# Altium schematic sheet flyback.SchDoc
size A4; SheetNumber: 4
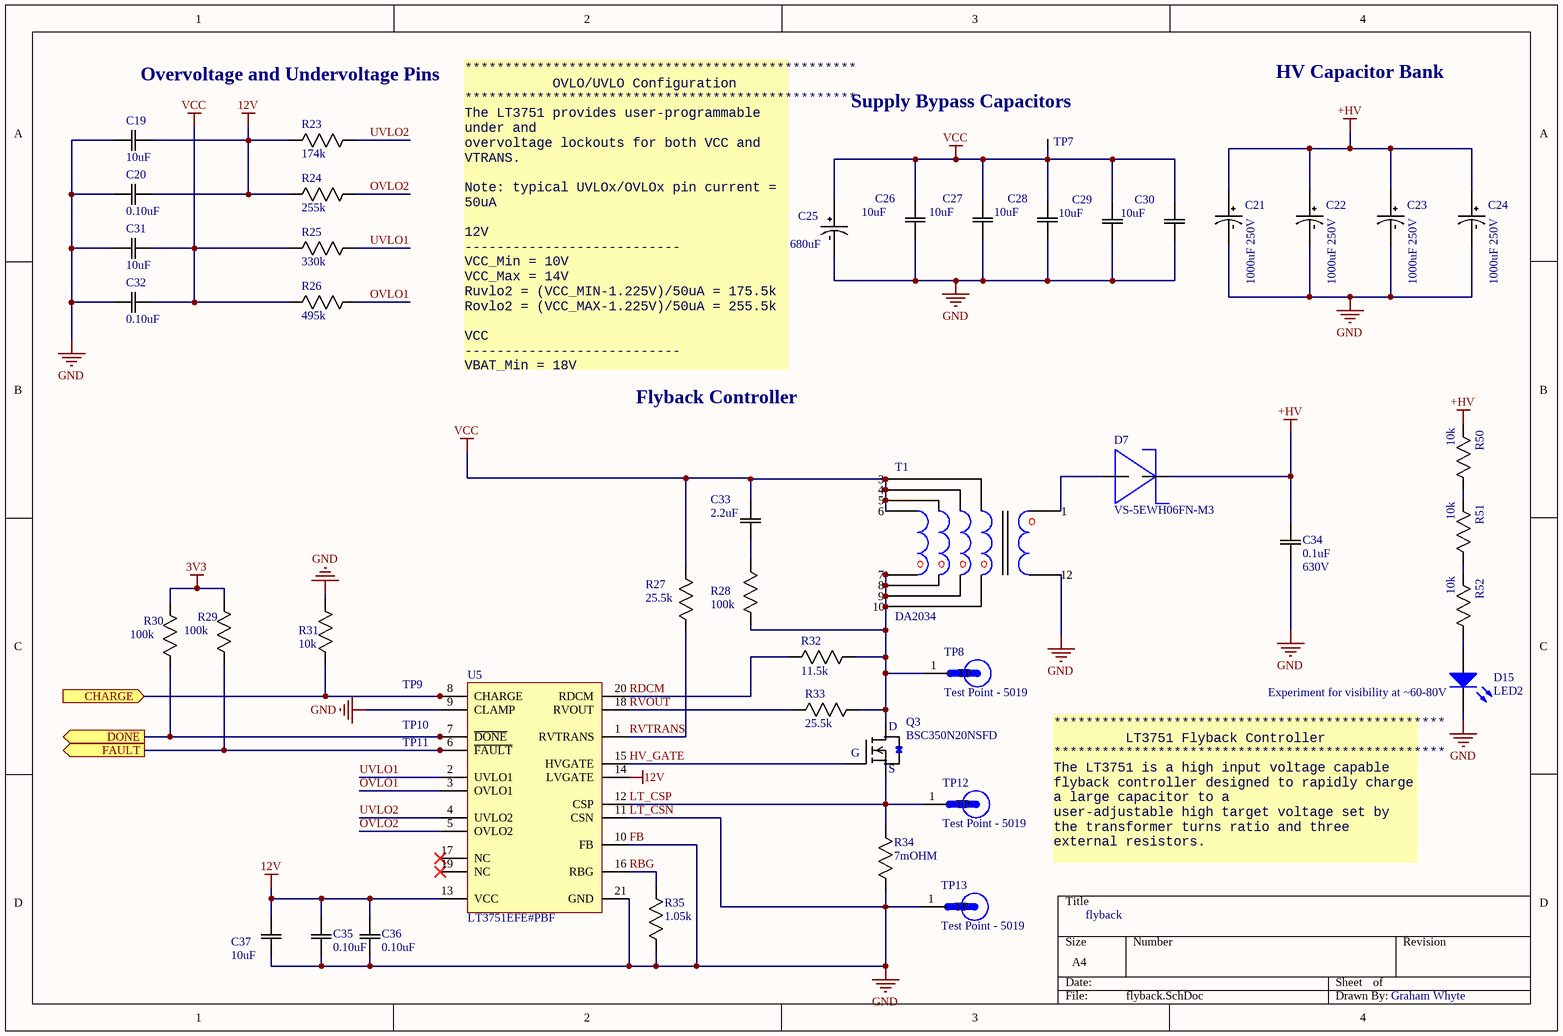
[diagram p0: flyback.SchDoc]

## Parts
C19  10uF  [0805]
C20  0.10uF  [0805]
C21  1000uF 250V  [RADIAL, CAN - THRU 25.4mm]
C22  1000uF 250V  [RADIAL, CAN - THRU 25.4mm]
C23  1000uF 250V  [RADIAL, CAN - THRU 25.4mm]
C24  1000uF 250V  [RADIAL, CAN - THRU 25.4mm]
C25  680uF  [RADIAL, CAN - THRU 10mm - RIGHTANGLE]
C26  10uF  [1210]
C27  10uF  [1210]
C28  10uF  [1210]
C29  10uF  [1210]
C30  10uF  [1210]
C31  10uF  [0805]
C32  0.10uF  [0805]
C33  2.2uF  [0805]
C34  Rating: 630V  [1210]  (hidden comment: 0.1uF)
C35  0.10uF  [0805]
C36  0.10uF  [0805]
C37  10uF  [0805]
D7  VS-5EWH06FN-M3  [DPAK (TO-252)]
D15  LED2  [3.2X1.6X1.1]
Q3  BSC350N20NSFD  [8-PowerSMD]
R23  174k  [0805]
R24  255k  [0805]
R25  330k  [0805]
R26  495k  [0805]
R27  25.5k  [0805]
R28  100k  [0805]
R29  100k  [0805]
R30  100k  [0805]
R31  10k  [0805]
R32  11.5k  [0805]
R33  25.5k  [0805]
R34  7mOHM  [2512]
R35  1.05k  [0805]
R50  10k  [1206]
R51  10k  [1206]
R52  10k  [1206]
T1  DA2034  [DA2034]
TP7  Test Point (Via)  [TP]  (value not drawn)
TP8  Test Point - 5019  [TP380X203]
TP9  Test Point (Via)  [TP]  (value not drawn)
TP10  Test Point (Via)  [TP]  (value not drawn)
TP11  Test Point (Via)  [TP]  (value not drawn)
TP12  Test Point - 5019  [TP380X203]
TP13  Test Point - 5019  [TP380X203]
U5  LT3751EFE#PBF  [LT-FE-20-EPV-CB_L]

## Ports
CHARGE (in), DONE (out), FAULT (out)

## Nets
3V3: R29.2(R2) R30.2(R2)
12V: C19.2(C2) C20.2(C2) C35.1(C1) C36.1(C1) C37.1(C1) R23.2(R2) R24.2(R2) U5.13(VCC) U5.14(LVGATE)
+HV: C21.POS C22.POS C23.POS C24.POS C34.1(C1) D7.OUT R50.2(R2)
FB: C19.1(C1) C20.1(C1) C21.NEG C22.NEG C23.NEG C24.NEG C25.NEG C26.1(C1) C27.1(C1) C28.1(C1) C29.1(C1) C30.1(C1) C31.1(C1) C32.1(C1) C34.2(C2) C35.2(C2) C36.2(C2) C37.2(C2) D15.2(K) R31.1(R1) R34.1(R1) R35.2(R2) T1.12 TP13.1(TP) U5.9(CLAMP) U5.10(FB) U5.11(CSN) U5.21(GND)  [also labelled GND, LT_CSN]
VCC: C25.POS C26.2(C2) C27.2(C2) C28.2(C2) C29.2(C2) C30.2(C2) C31.2(C2) C32.2(C2) C33.2(C2) R25.2(R2) R26.2(R2) R27.1(R1) T1.3 T1.4 T1.5 T1.6 TP7.1
CHARGE: R31.2(R2) TP9.1 U5.8(CHARGE) ; port CHARGE
DONE: R30.1(R1) TP10.1 U5.7(~{DONE}) ; port DONE
FAULT: R29.1(R1) TP11.1 U5.6(~{FAULT}) ; port FAULT
HV_GATE: Q3.G U5.15(HVGATE)
LT_CSP: Q3.S R34.2(R2) TP12.1(TP) U5.12(CSP)
OVLO1: R26.1(R1) U5.3(OVLO1)
OVLO2: R24.1(R1) U5.5(OVLO2)
RBG: R35.1(R1) U5.16(RBG)
RDCM: R32.2(R2) U5.20(RDCM)
RVOUT: R33.2(R2) U5.18(RVOUT)
RVTRANS: R27.2(R2) U5.1(RVTRANS)
UVLO1: R25.1(R1) U5.2(UVLO1)
UVLO2: R23.1(R1) U5.4(UVLO2)
NetC33_1: C33.1(C1) R28.1(R1)
NetD7_IN: D7.IN T1.1
NetD15_1: D15.1(A) R52.1(R1)
NetQ3_D: Q3.D R28.2(R2) R32.1(R1) R33.1(R1) T1.7 T1.8 T1.9 T1.10 TP8.1(TP)
NetR50_1: R50.1(R1) R51.2(R2)
NetR51_1: R51.1(R1) R52.2(R2)

Not connected (* = marked no-connect by the designer): U5 17(NC)* 19(NC)*

## Notes on the sheet
- Overvoltage and Undervoltage Pins
- (near TP7) Supply Bypass Capacitors
- HV Capacitor Bank
- (near C25) *************************************************
  OVLO/UVLO Configuration
  *************************************************
  The LT3751 provides user-programmable under and
  overvoltage lockouts for both VCC and VTRANS.
  Note: typical UVLOx/OVLOx pin current = 50uA
  12V
  ---------------------------
  VCC_Min = 10V
  VCC_Max = 14V
  Ruvlo2 = (VCC_MIN-1.225V)/50uA = 175.5k
  Rovlo2 = (VCC_MAX-1.225V)/50uA = 255.5k
  VCC
  ---------------------------
  VBAT_Min = 18V
  VBAT_Max = 26V
  Ruvlo1 = (VBAT_MIN-1.225V)/50uA = 335.5k
  Rovlo1 = (VBAT_MAX-1.225V)/50uA = 495.5k
- Flyback Controller
- (near D15) Experiment for visibility at ~60-80V
- (near D15) *************************************************
  LT3751 Flyback Controller
  *************************************************
  The LT3751 is a high input voltage capable flyback controller designed to rapidly charge a large capacitor to a
  user-adjustable high target voltage set by the transformer turns ratio and three external resistors.
- flyback
- Graham Whyte

## Library data of the parts
C19 C26-C31 C37 = CAP 10uF 35V: CAP CER 10UF 35V X7R 0805; Tolerance: 10%; Package: 0805; Value: 10uF; Rating: 35V; Temperature Coefficient: X7R; Operating Temperature: -55°C ~ 125°C
C20 C32 C35 C36 = CAP 0.10uF 35V: CAP CER 0.10UF 35V X7R 0603/0805; Tolerance: 10%; Package: 0603/0805; Temperature Coefficient: X7R; Operating Temperature: -55°C ~ 125°C; Value: 0.10uF
C21-C24 = CAP POL 1000uF: United Chemi-Con / ESMQ251VSN102MQ45S; Dielectric Material: Aluminium; Life (Hours): 2000Hour; Capacitance: 1mF; Tolerance: 20%; Ripple Current: 960mA; Lead Diameter: 2mm; Supplier 1: Digi-Key; Manufacturer: United Chemi-Con; Manufacturer Part Number: ESMQ251VSN102MQ45S; RoHS: Yes; Mount: Through Hole,PCB; Case/Package: Radial; Number of Pins: 2; Min Operating Temperature: -40°C; Max Operating Temperature: 85°C; Termination: Radial; Voltage: 250V; Diameter: 25.4mm; Height - Seated (Max): 45mm; Lead Pitch: 10mm; REACH SVHC: No SVHC; Lead Free: Lead Free; Supplier Part Number 1: 565-2754-ND
C25 = CAP POL 680uF TH: NICHICON   UHW1V681MPD6 ALUMINUM ELECTROLYTIC CAPACITOR, 680UF, 35V, 20%, RADIAL, FULL REEL; Dielectric Material: Aluminium; Tolerance: 20%; Supplier 1: Digi-Key; Manufacturer: Nichicon; Manufacturer Part Number: UHW1V681MPD6; RoHS: Yes; Case/Package: Radial; Number of Pins: 2; Capacitance: 680uF; Termination: Radial; Voltage: 35V; Supplier Part Number 1: 493-6804-ND
C33 = CAP 2.2uF 16V: CAP CER 2.2UF 16V X5R 0603/0805; Tolerance: 10%; Package: 0603/0805; Value: 2.2uF; Rating: 16V; Temperature Coefficient: X5R; Operating Temperature: -55°C ~ 85°C
C34 = CAP 0.1uF 630V: CAP CER 0.1uF 630V X7R 1210; Tolerance: 10%; Package: 1210; Temperature Coefficient: X7R; Operating Temperature: -55°C ~ 125°C; Value: 0.1uF
D7 = VS-5EWH06FN-M3: Diode Switching 600V 5A DPAK; pin to pad: IN>3 OUT>2; MF: Vishay Diodes; MF PN: VS-5EWH06FN-M3; Digikey: VS-5EWH06FN-M3-ND; Digikey Link: https://www.digikey.ca/en/products/detail/vishay-semiconductor-diodes-division/VS-5EWH06FN-M3/4934509
D15 = LED GREEN SMD: Typical RED, GREEN, YELLOW, AMBER GaAs LED; Voltage - Forward (Vf) (Typ): 2V; Lens Transparency: Clear; Current - Test: 20mA; Package: 1206; Color: Green
Q3 = MOSFET BSC320N20NS3: MOSFET N-CH 36A 200V; MF: Infineon; Package: 8-PowerTDFN; Digikey: BSC320N20NS3GATMA1CT-ND; Digikey Link: https://www.digikey.ca/en/products/detail/infineon-technologies/BSC320N20NS3GATMA1/2337851; Supplier 1: Digi-Key; Supplier Part Number 1: BSC320N20NS3GATMA1CT-ND
R23 = RES 174k 1/8W: RES SMD 174K OHM 1% 1/8W 0805; Manufacturer: Yageo; Manufacturer Part Number: RC0805FR-07174KL; Max Power Dissipation: 125mW; Resistance: 174kR; Temperature Coefficient: 100ppm/°C; Voltage Rating: 150V; Supplier 1: Digi-Key; RoHS: Yes; Category: Chip SMD Resistors; Stock 1: 27863; Pricing 1: 1=0.10000, 10=0.04000, 100=0.01630, 1000=0.00731, 2500=0.00635 (USD); Case/Package: 0805; Case Code (Metric): 2012; Case Code (Imperial): 0805; Contact Plating: Tin,Matte; Min Operating Temperature: -55°C; Max Operating Temperature: 155°C; Package Quantity: 1; Power Rating: 125mW; Tolerance: 1%; Packaging: Tape and Reel; Features: Moisture Resistant; Composition: Thick Film; Number of Terminations: 2; Termination: SMD/SMT; Military Standard: Not; Voltage Rating (DC): 150V; Length: 2mm; Height: 0.024inch; Width: 0.049inch; Depth: 1.25mm; Radiation Hardening: No; Lead Free: Lead Free; ComponentLink1URL: https://datasheet.ciiva.com/2509/pyu-r-int-thick-7-2509472.pdf?src-supplier=Digi-Key; ComponentLink1Description: https://datasheet.ciiva.com/2509/pyu-r-int-thick-7-2509472.pdf?src-supplier=Digi-Key; ComponentLink2URL: https://datasheet.ciiva.com/2509/pyu-r-int-thick-7-2509471.pdf?src-supplier=Digi-Key; ComponentLink2Description: https://datasheet.ciiva.com/2509/pyu-r-int-thick-7-2509471.pdf?src-supplier=Digi-Key; ComponentLink3URL: https://datasheet.ciiva.com/2509/pyu-r-int-thick-7-2509473.pdf?src-supplier=Digi-Key; ComponentLink3Description: https://datasheet.ciiva.com/2509/pyu-r-int-thick-7-2509473.pdf?src-supplier=Digi-Key; Supplier Part Number 1: 311-174KCRCT-ND
R24 = RES 255k 0805: 0805 Resistor, 6A, 0.125W, 25ppm, 0.1%, 255K; Manufacturer: Panasonic; Manufacturer Part Number: ERA-6AEB2553V; Max Power Dissipation: 125mW; Resistance: 255kR; Temperature Coefficient: 25ppm/°C; Voltage Rating (DC): 100V; Voltage Rating: 200V; Supplier 1: Digi-Key; RoHS: Yes; Category: Chip SMD Resistors; Stock 1: 7869; Pricing 1: 1=0.36000, 10=0.30200, 100=0.11820, 1000=0.04948, 2500=0.04536 (USD); Mount: Surface Mount; Case/Package: 0805; Number of Pins: 2; Weight: 0.000194oz; Case Code (Imperial): 0805; Case Code (Metric): 2012; Contact Plating: Tin; Min Operating Temperature: -55°C; Max Operating Temperature: 155°C; Features: Automotive AEC-Q200; Tolerance: 0.1%; Number of Terminations: 2; Packaging: Tape and Reel; Composition: Metal Film,Thin Film; Power Rating: 125mW; Termination: SMD/SMT; Military Standard: Not; Package Quantity: 1; Length: 2mm; Height: 0.5mm; Width: 1.25mm; Depth: 1.25mm; Radiation Hardening: No; Lead Free: Lead Free; REACH SVHC: No SVHC; ComponentLink1URL: https://datasheet.ciiva.com/11810/0900766b80eb1d8c-11810615.pdf?src-supplier=RSComponents; ComponentLink1Description: https://datasheet.ciiva.com/11810/0900766b80eb1d8c-11810615.pdf?src-supplier=RSComponents; ComponentLink2URL: https://datasheet.ciiva.com/41450/001181380-da-01-en-widerstand-era-0805-255k-0-1-5000st-41450539.pdf?src-supplier=Conrad; ComponentLink2Description: https://datasheet.ciiva.com/41450/001181380-da-01-en-widerstand-era-0805-255k-0-1-5000st-41450539.pdf?src-supplier=Conrad; ComponentLink3URL: https://datasheet.ciiva.com/5981/485442-5981317.pdf?src-supplier=Farnell; ComponentLink3Description: https://datasheet.ciiva.com/5981/485442-5981317.pdf?src-supplier=Farnell; ComponentLink4URL: https://datasheet.ciiva.com/5981/485442-5981318.pdf?src-supplier=Farnell; ComponentLink4Description: https://datasheet.ciiva.com/5981/485442-5981318.pdf?src-supplier=Farnell; ComponentLink5URL: https://datasheet.ciiva.com/5981/485442-5981319.pdf?src-supplier=Farnell; ComponentLink5Description: https://datasheet.ciiva.com/5981/485442-5981319.pdf?src-supplier=Farnell; ComponentLink6URL: https://datasheet.ciiva.com/5981/485442-5981320.pdf?src-supplier=Farnell; ComponentLink6Description: https://datasheet.ciiva.com/5981/485442-5981320.pdf?src-supplier=Farnell; ComponentLink7URL: https://datasheet.ciiva.com/17206/aoa0000ce26-17206655.pdf?src-supplier=Avnet+Europe; ComponentLink7Description: https://datasheet.ciiva.com/17206/aoa0000ce26-17206655.pdf?src-supplier=Avnet+Europe; Supplier Part Number 1: P255KDACT-ND
R25 = RES 330k 1/8W - 1%: RES SMD 274K OHM 1% 1/8W 0805
R26 = RES 495k 1/8W: RES SMD 499K OHM 1% 1/8W 0805; Manufacturer: Yageo; Manufacturer Part Number: RC0805FR-07499KL; Temperature Coefficient: 100ppm/°C; Voltage Rating (DC): 150V; Resistance: 499kR; Power Rating: 125mW; Supplier 1: Digi-Key; RoHS: Yes; Category: Chip SMD Resistors; Stock 1: 2275; Pricing 1: 1=0.10000, 10=0.04000, 100=0.01630, 1000=0.00731, 2500=0.00635 (USD); Case/Package: 0805; Case Code (Metric): 2012; Case Code (Imperial): 0805; Contact Plating: Tin,Lead,Matte; Min Operating Temperature: -55°C; Max Operating Temperature: 155°C; Termination: SMD/SMT; Composition: Thick Film; Military Standard: Not; Tolerance: 1%; Voltage Rating: 150V; Packaging: Tape and Reel; Length: 2mm; Depth: 1.25mm; Radiation Hardening: No; Lead Free: Lead Free; ComponentLink1URL: https://datasheet.ciiva.com/15189/getdatasheetpartid-326570-15189975.pdf?src-supplier=Verical; ComponentLink1Description: https://datasheet.ciiva.com/15189/getdatasheetpartid-326570-15189975.pdf?src-supplier=Verical; Supplier Part Number 1: 311-499KCRCT-ND
R27 R33 = RES 25.5k 1/8W: RES SMD 25.5K OHM 0.1% 1/8W 0805; Manufacturer: Panasonic; Manufacturer Part Number: ERA-6AEB2552V; Temperature Coefficient: 25ppm/°C; Max Power Dissipation: 125mW; Resistance: 25.5kR; Voltage Rating: 100V; Supplier 1: Digi-Key; RoHS: Yes; Category: Chip SMD Resistors; Stock 1: 5872; Pricing 1: 1=0.36000, 10=0.30200, 100=0.11820, 1000=0.04948, 2500=0.04536 (USD); Mount: Surface Mount; Case/Package: 0805; Number of Pins: 2; Case Code (Imperial): 0805; Case Code (Metric): 2012; Contact Plating: Tin; Min Operating Temperature: -55°C; Max Operating Temperature: 155°C; Number of Terminations: 2; Features: Automotive AEC-Q200; Tolerance: 0.1%; Composition: Metal Film,Thin Film; Packaging: Tape and Reel; Military Standard: Not; Termination: Solder; Power Rating: 125mW; Package Quantity: 1; Voltage Rating (DC): 100V; Length: 2mm; Height: 0.5mm; Width: 1.25mm; Depth: 1.25mm; Radiation Hardening: No; Lead Free: Lead Free; ComponentLink1URL: https://datasheet.ciiva.com/11810/0900766b80eb1d8c-11810651.pdf?src-supplier=RSComponents; ComponentLink1Description: https://datasheet.ciiva.com/11810/0900766b80eb1d8c-11810651.pdf?src-supplier=RSComponents; ComponentLink2URL: https://datasheet.ciiva.com/26335/459526-da-01-en-widerstand-0805-era-26335831.pdf?src-supplier=Conrad; ComponentLink2Description: https://datasheet.ciiva.com/26335/459526-da-01-en-widerstand-0805-era-26335831.pdf?src-supplier=Conrad; ComponentLink3URL: https://datasheet.ciiva.com/7870/485442-7870651.pdf?src-supplier=Element14; ComponentLink3Description: https://datasheet.ciiva.com/7870/485442-7870651.pdf?src-supplier=Element14; ComponentLink4URL: https://datasheet.ciiva.com/5987/485442-5987308.pdf?src-supplier=Farnell; ComponentLink4Description: https://datasheet.ciiva.com/5987/485442-5987308.pdf?src-supplier=Farnell; ComponentLink5URL: https://datasheet.ciiva.com/7870/485442-7870652.pdf?src-supplier=Element14; ComponentLink5Description: https://datasheet.ciiva.com/7870/485442-7870652.pdf?src-supplier=Element14; ComponentLink6URL: https://datasheet.ciiva.com/30151/54aoa0000ce26-30151583.pdf?src-supplier=Onlinecomponents.com; ComponentLink6Description: https://datasheet.ciiva.com/30151/54aoa0000ce26-30151583.pdf?src-supplier=Onlinecomponents.com; ComponentLink7URL: https://datasheet.ciiva.com/9191/aoa0000ce26-9191422.pdf?src-supplier=Avnet; ComponentLink7Description: https://datasheet.ciiva.com/9191/aoa0000ce26-9191422.pdf?src-supplier=Avnet; Supplier Part Number 1: P25.5KDACT-ND
R28-R30 = RES 100k 1/8W - 1%: RES SMD 100K OHM 1% 1/8W 0805; Power (Watts): 0.125W; Package: 0805; Value: 100k; Tolerance: 1%
R31 = RES 10k 1/8W - 1%: RES SMD 10K OHM 1% 1/8W 0805; Power (Watts): 0.125W; Package: 0805; Value: 10k; Tolerance: 1%
R32 = RES 11.5k 1/8W: RES SMD 11.5K OHM 0.1% 1/8W 0805 Thin Film; Manufacturer: Panasonic; Manufacturer Part Number: ERA-6AEB1152V; Power Rating: 125mW; Resistance: 11.5kR; Voltage Rating: 100V; Temperature Coefficient: 25ppm/°C; Supplier 1: Digi-Key; RoHS: Yes; Category: Chip SMD Resistors; Stock 1: 10661; Pricing 1: 1=0.34000, 10=0.28800, 100=0.11260, 1000=0.04712, 2500=0.04320 (USD); Mount: Surface Mount; Case/Package: 0805; Number of Pins: 2; Case Code (Metric): 2012; Case Code (Imperial): 0805; Contact Plating: Tin; Min Operating Temperature: -55°C; Max Operating Temperature: 155°C; Tolerance: 0.1%; Packaging: Tape and Reel; Max Power Dissipation: 125mW; Composition: Thin Film,Metal Film; Number of Terminations: 2; Voltage Rating (DC): 100V; Termination: Solder; Military Standard: Not; Package Quantity: 1; Features: Automotive AEC-Q200; Length: 2mm; Height: 0.5mm; Width: 1.25mm; Depth: 1.25mm; Radiation Hardening: No; Lead Free: Lead Free; ComponentLink1URL: https://datasheet.ciiva.com/11810/0900766b80eb1d8c-11810868.pdf?src-supplier=RSComponents; ComponentLink1Description: https://datasheet.ciiva.com/11810/0900766b80eb1d8c-11810868.pdf?src-supplier=RSComponents; ComponentLink2URL: https://datasheet.ciiva.com/41450/001181306-da-01-en-widerstand-era-0805-11k5-0-1-5000st-41450464.pdf?src-supplier=Conrad; ComponentLink2Description: https://datasheet.ciiva.com/41450/001181306-da-01-en-widerstand-era-0805-11k5-0-1-5000st-41450464.pdf?src-supplier=Conrad; ComponentLink3URL: https://datasheet.ciiva.com/5987/485442-5987301.pdf?src-supplier=Farnell; ComponentLink3Description: https://datasheet.ciiva.com/5987/485442-5987301.pdf?src-supplier=Farnell; ComponentLink4URL: https://datasheet.ciiva.com/7829/485442-7829142.pdf?src-supplier=Element14; ComponentLink4Description: https://datasheet.ciiva.com/7829/485442-7829142.pdf?src-supplier=Element14; ComponentLink5URL: https://datasheet.ciiva.com/17211/aoa0000ce26-17211855.pdf?src-supplier=Avnet+Europe; ComponentLink5Description: https://datasheet.ciiva.com/17211/aoa0000ce26-17211855.pdf?src-supplier=Avnet+Europe; ComponentLink6URL: https://datasheet.ciiva.com/7829/485442-7829143.pdf?src-supplier=Element14; ComponentLink6Description: https://datasheet.ciiva.com/7829/485442-7829143.pdf?src-supplier=Element14; ComponentLink7URL: https://datasheet.ciiva.com/9193/aoa0000ce26-9193735.pdf?src-supplier=Avnet; ComponentLink7Description: https://datasheet.ciiva.com/9193/aoa0000ce26-9193735.pdf?src-supplier=Avnet; ComponentLink8URL: https://datasheet.ciiva.com/24024/aoa0000ce26-197354-24024328.pdf?src-supplier=Mouser; ComponentLink8Description: https://datasheet.ciiva.com/24024/aoa0000ce26-197354-24024328.pdf?src-supplier=Mouser; Supplier Part Number 1: P11.5KDACT-ND
R34 = RES 7m 3W: RES SMD 7m OHM 1% 3W 2512; MFG: VISHAY; Package: 1206; Resistance: 7mOHM; Power (Watts): 3W; Tolerance: 1%
R35 = RES 1.05k 1/8W: RES SMD 1.05K OHM 0.1% 1/8W 0805; Wattage: 0.125W; Supplier 1: Digi-Key; Tolerance: 0.1%; Supplier Part Number 1: P1.05KDACT-ND; Value: 1.05k; Package: 0805
R50-R52 = RES 10k 1W: RES SMD 10K OHM 1% 1W 1206; Power (Watts): 0.125W; Package: 0805; Value: 10k; Tolerance: 1%
T1 = DA2034: Audio Transformers / Signal Transformers DA2032 Cap Chrgr For Linear LT3750/51; Supplier 1: Mouser; Supplier Part Number 1: 994-DA2034-ALB
TP8 TP12 TP13 = Test Point - 5019: PC Test Point, Miniature Phosphor Bronze, Silver Plating Surface Mount Mounting Type; MP: 5019; MF: Keystone Electronics; Value: *; Package: 2010 Keystone; Digi-Key_Part_Number: 36-5019CT-ND; Digi-Key_Purchase_URL: https://www.digikey.com/product-detail/en/keystone-electronics/5019/36-5019CT-ND/3907344?utm_source=snapeda&utm_medium=aggregator&utm_campaign=symbol
U5 = LT3751EFE#PBF: Controller to 20-Pin TSSOP EP; Manufacturer: Analog Devices / Linear Technology; Output Voltage: 500V; Output Current: 150mA; Max Input Voltage: 24V; Min Supply Voltage: 4.75V; Number of Outputs: 1; Operating Supply Current: 5.5mA; Supplier 1: Digi-Key; Manufacturer Part Number: LT3751EFE#PBF; RoHS: Yes; Category: Voltage Regulators - Switching; Stock 1: 1231; Pricing 1: 1=9.26000, 25=6.14640, 100=5.08200, 250=4.82792, 500=4.71900 (USD); Case/Package: TSSOP; Number of Pins: 20; Min Operating Temperature: -40°C; Max Operating Temperature: 125°C; Package Quantity: 74; Packaging: Rail/Tube; Termination: SMD/SMT; Max Supply Voltage: 24V; Radiation Hardening: No; REACH SVHC: No SVHC; ComponentLink1URL: https://datasheet.ciiva.com/15104/getdatasheetpartid-472813-15104438.pdf?src-supplier=Verical; ComponentLink1Description: https://datasheet.ciiva.com/15104/getdatasheetpartid-472813-15104438.pdf?src-supplier=Verical; ComponentLink2URL: https://datasheet.ciiva.com/31429/1692507-31429494.pdf?src-supplier=Farnell; ComponentLink2Description: https://datasheet.ciiva.com/31429/1692507-31429494.pdf?src-supplier=Farnell; ComponentLink3URL: https://datasheet.ciiva.com/1964/27024-1964843.pdf?src-supplier=Digi-Key; ComponentLink3Description: https://datasheet.ciiva.com/1964/27024-1964843.pdf?src-supplier=Digi-Key